# EAGLE design Grove - GSR v1.0 (EAGLE 6.3)
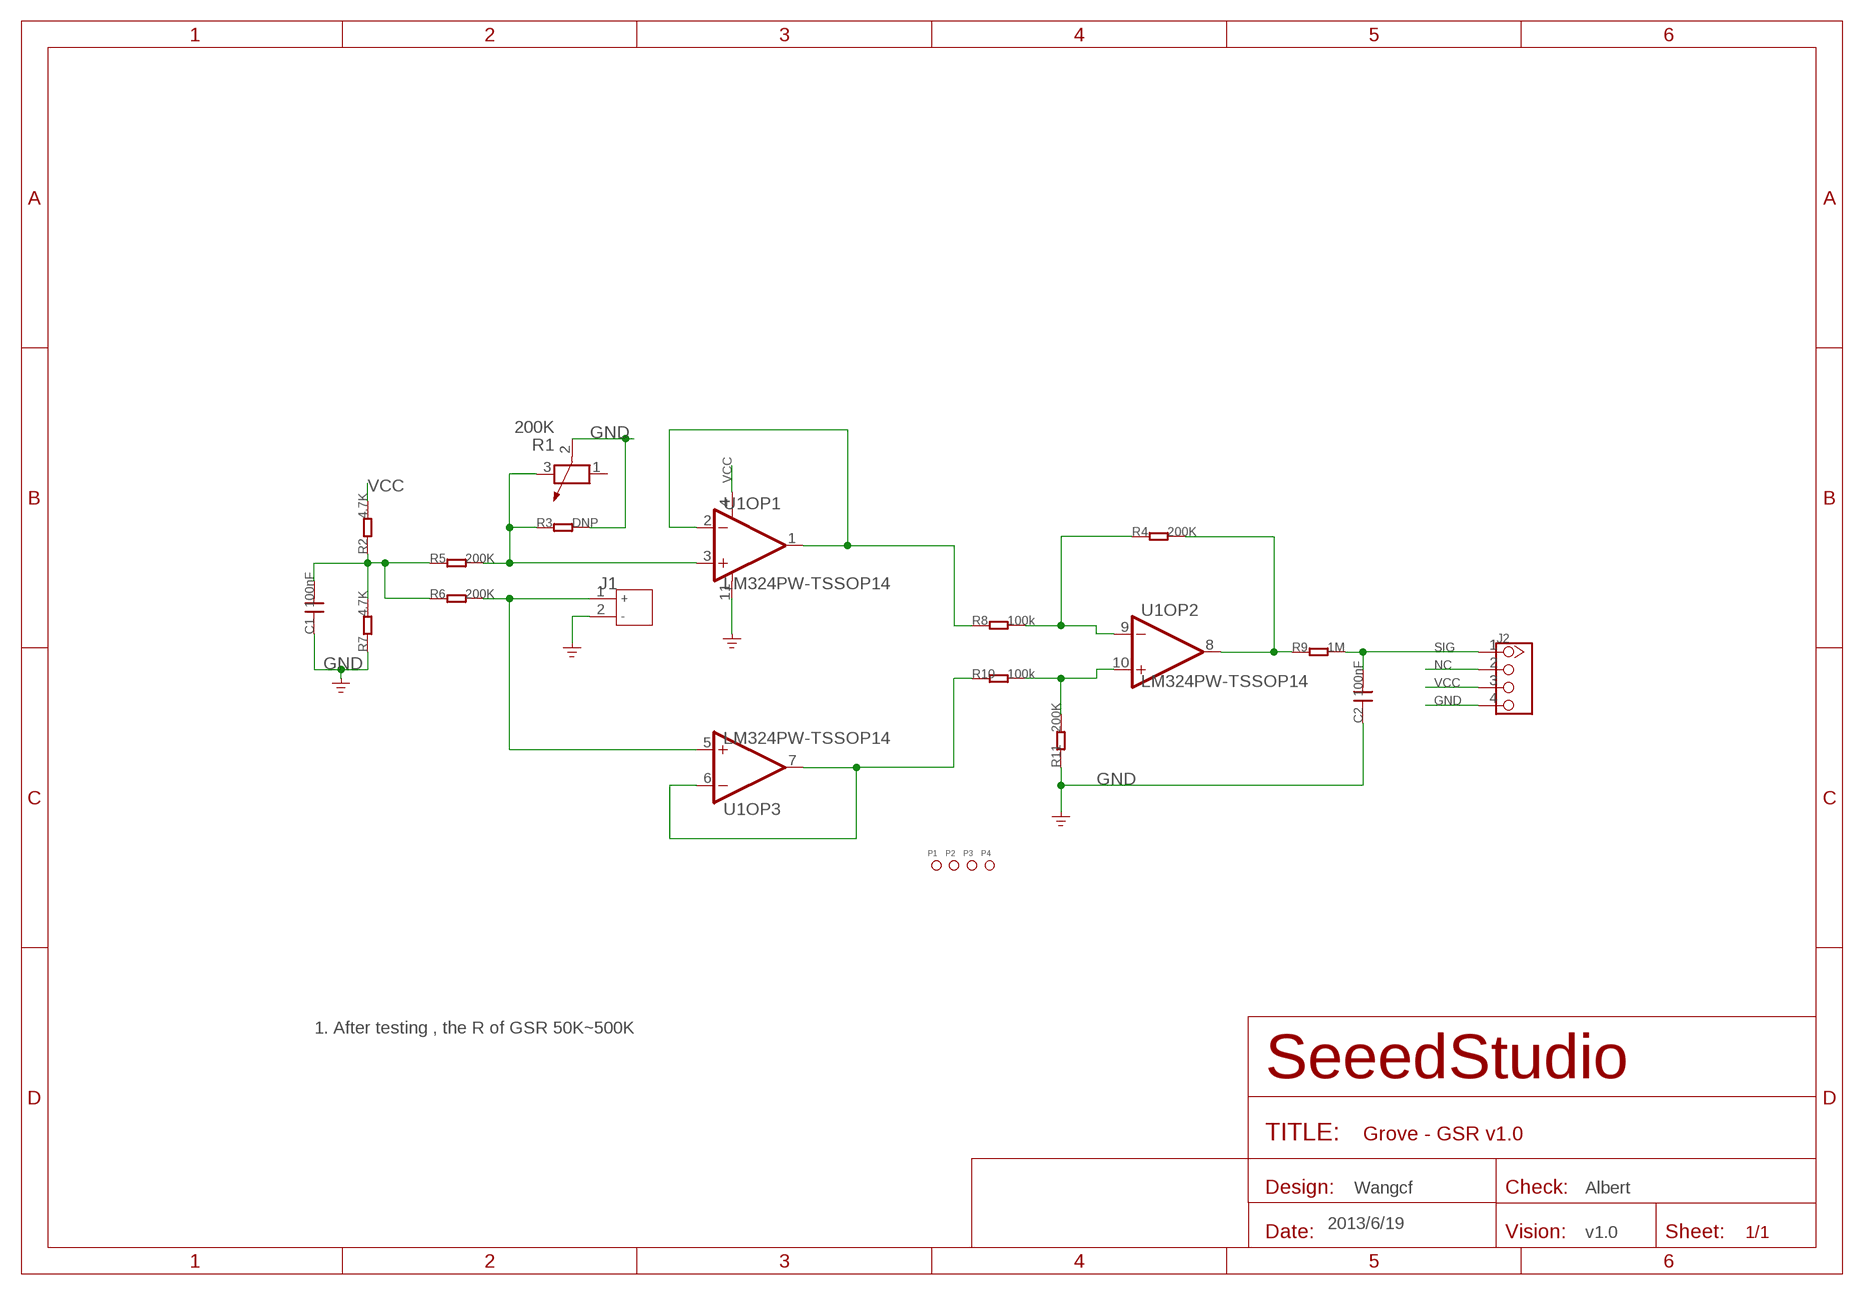
[diagram p0: schematic, sheet 1]

## Parts
C1  100nF  C-0603  [0603]
C2  100nF  C-0603  [0603]
J1  JACK-JST-2P-PW'2.0'  [JST-2.0]
J2  TWIG-4P-2.0-2.0  [4P-2.0]
P1  PAD-MARK  [ROUND-MARK-1.0]
P2  PAD-MARK  [ROUND-MARK-1.0]
P3  PAD-MARK  [ROUND-MARK-1.0]
P4  PAD-MARK  [ROUND-MARK-1.0]
R1  200K  R-POTENTIOMETER-SMD  [3P-SMD-RECT-3.3X3.6]
R2  4.7K  R-0603  [0603]
R3  DNP  R-0603  [0603]
R4  200K  R-0603  [0603]
R5  200K  R-0603  [0603]
R6  200K  R-0603  [0603]
R7  4.7K  R-0603  [0603]
R8  100k  R-0603  [0603]
R9  1M  R-0603  [0603]
R10  100k  R-0603  [0603]
R11  200K  R-0603  [0603]
U1  LM324PW-TSSOP14  LMV324-TSSOP14  [TSSOP14]

## Nets
GND: C1.1 C2.1 J1.2 J2.4 R1.2 R3.2 R7.1 R11.1 U1.11(OP1:V-)
IN: J1.1 R6.2 U1.5(OP3:IN+)
N$1: R8.1 U1.1(OP1:OUT) U1.2(OP1:IN-)
N$2: R10.1 U1.6(OP3:IN-) U1.7(OP3:OUT)
N$3: R4.1 R8.2 U1.9(OP2:IN-)
N$4: R4.2 R9.1 U1.8(OP2:OUT)
N$5: R10.2 R11.2 U1.10(OP2:IN+)
N$6: C1.2 R2.1 R5.1 R6.1 R7.2
N$8: R1.3 R3.1 R5.2 U1.3(OP1:IN+)
NC: J2.2
SIG: C2.2 J2.1 R9.2
VCC: J2.3 R2.2 U1.4(OP1:V+)
Unconnected: R1.1 U1.12(OP4:IN+) U1.13(OP4:IN-) U1.14(OP4:OUT)

## Notes on the sheet
- 1. After testing , the R of GSR 50K~500K
- Wangcf | Albert
- 2013/6/19
- v1.0

## Library data of the parts
C1 C2 = Discreter:C*: Ceramic Capacitors
J1 = Connector:JACK-JST-2P-PW
J2 = Connector:TWIG-4P-2.0
P1-P4 = Discrete:PAD-MARK; PARTNO: DNP
R1 = Discreter:R-POTENTIOMETER*: Potentiometer
R2-R11 = Discreter:R*
U1 = IC:LMV324: General purpose LOW Voltage, Rail-to-Rail Output Amplifiers http://www.fairchildsemi.com/ds/LM/LMV358.pdf

## Board
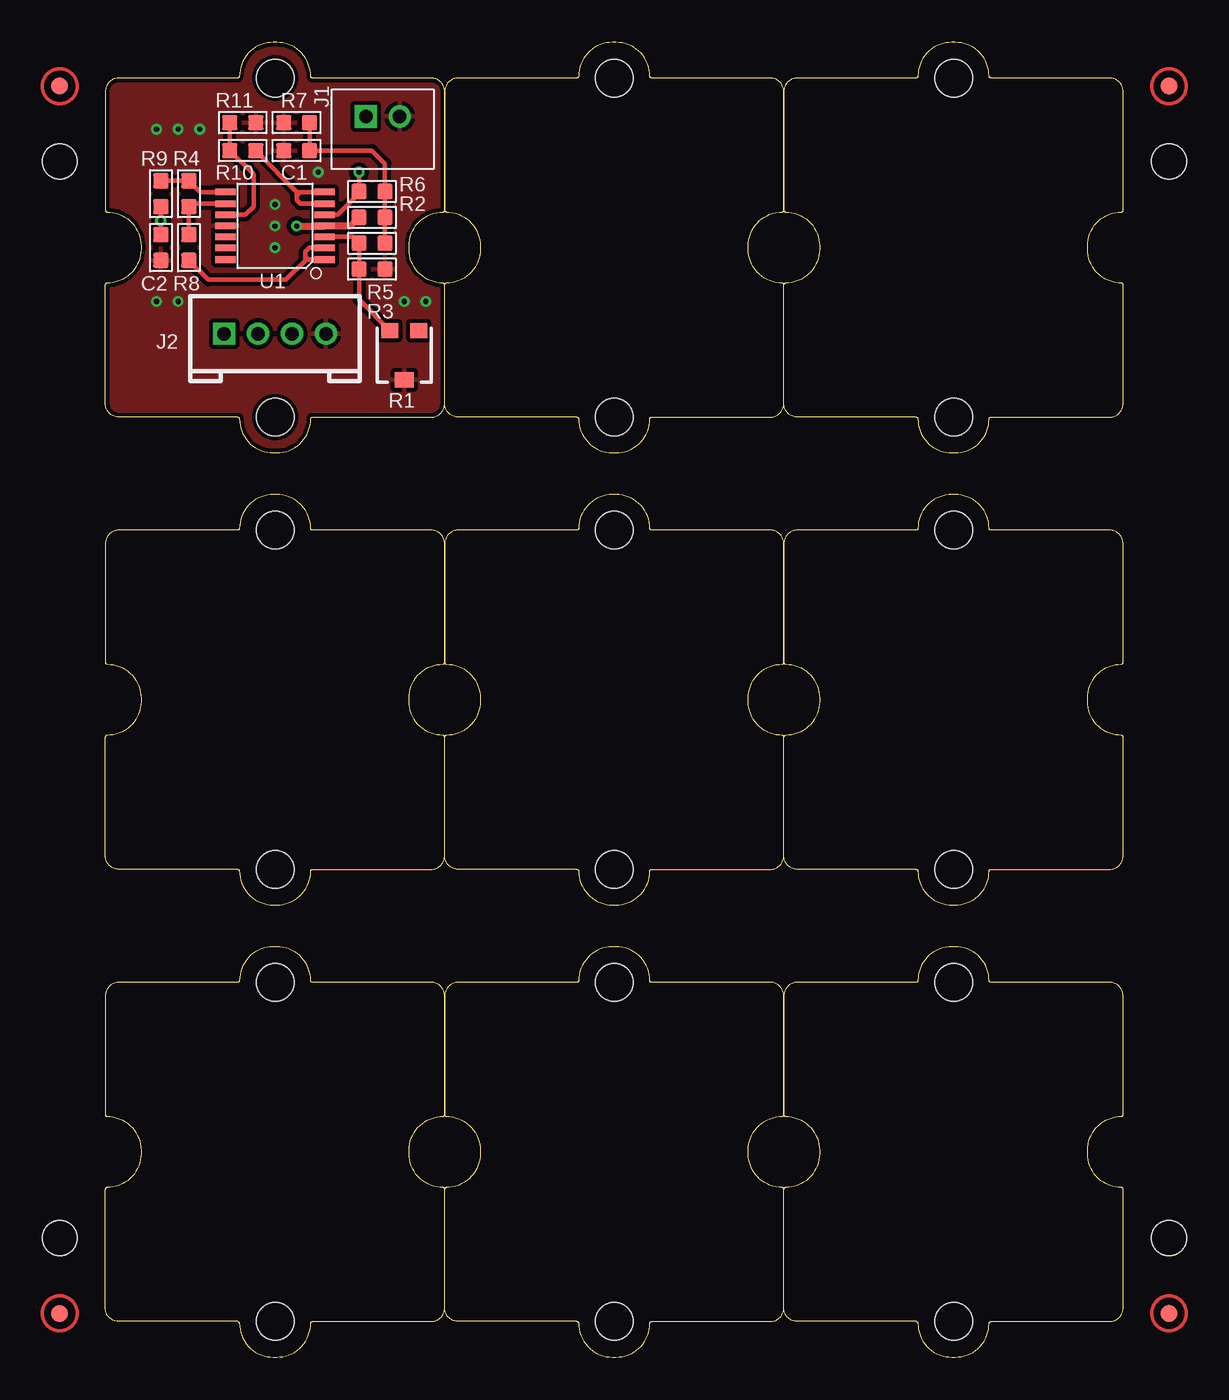
[diagram p1: board, top side]
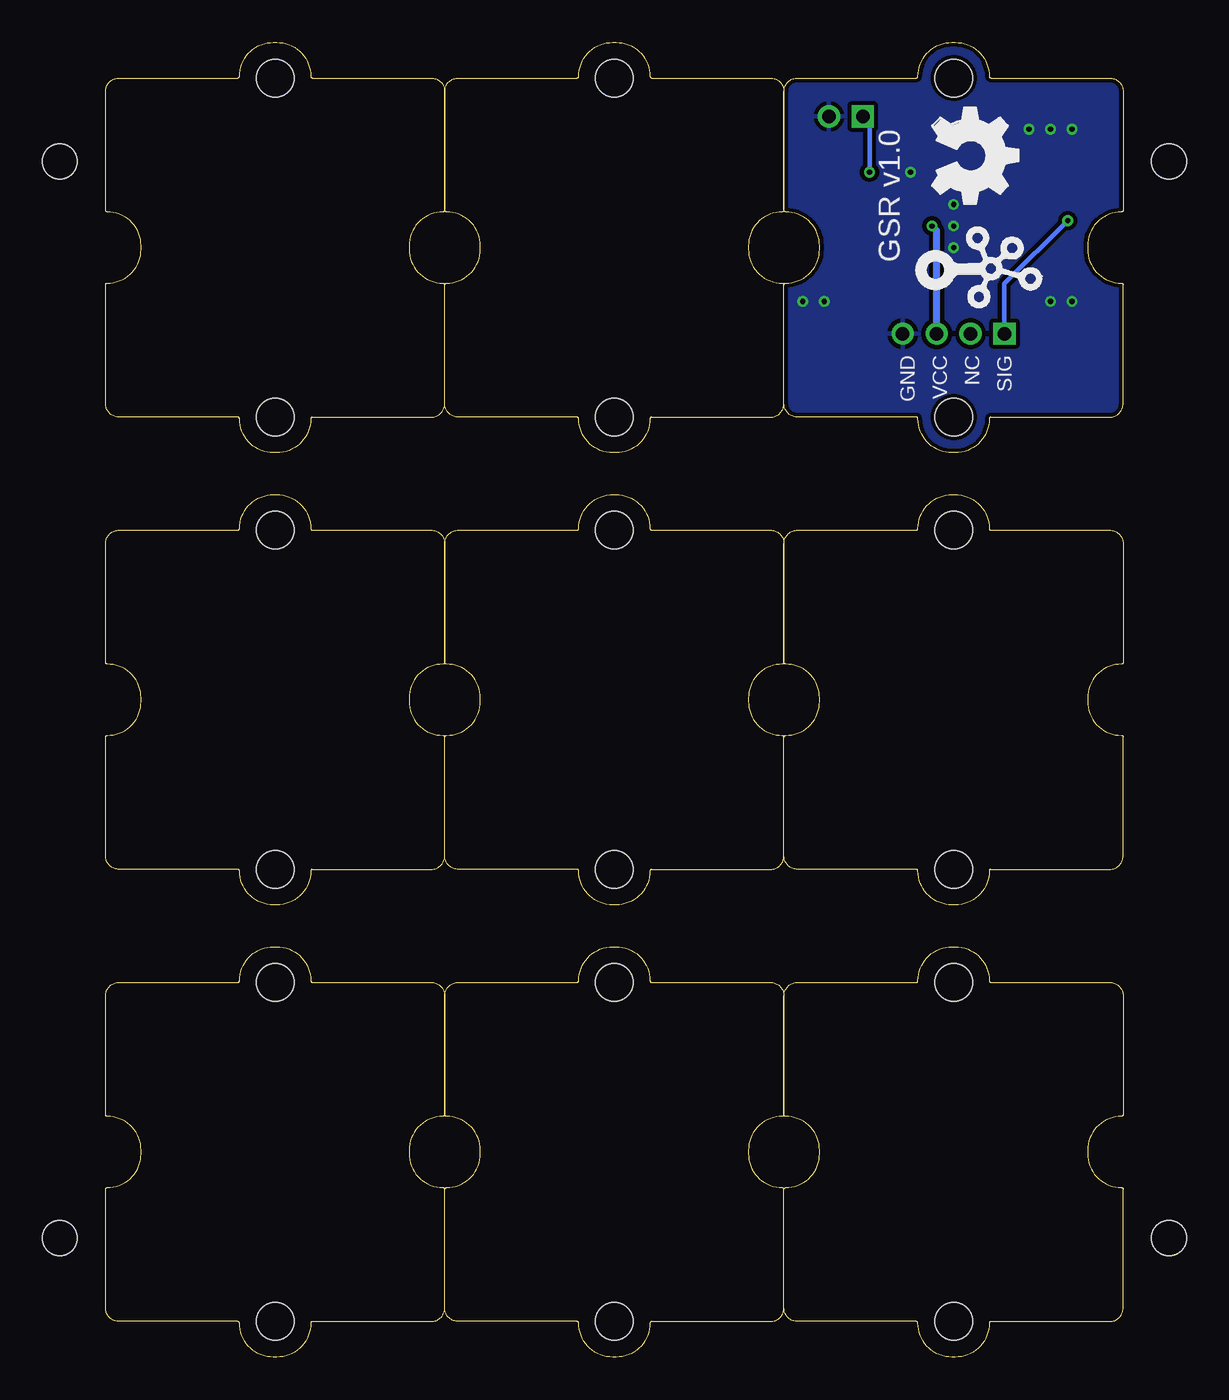
[diagram p2: board, bottom side, seen from below]

Size 60 x 77.54 mm. Coordinates in mm from the lower left corner, seen from the top.
Copper layers (1*16): Top 0.035mm / dielectric 1.5mm / Bottom 0.035mm
Design rules "SeeedStudio_rule_no_angle_090911 *": minimum track width 6mil, minimum drill 12mil, track to track 6mil, track to pad 6mil, pad to pad 6mil, via to via 6mil, smd to smd 0mil, copper to edge 10mil, drill to drill 10mil, minimum pad ring 10mil, minimum via ring 6mil, stop-mask expansion 2mil, vias tented up to drill 100mil, thermal gap 10mil
Holes 2.03 mm at -2.7,70.52 62.7,7.02 -2.7,7.02 62.7,70.52

### Footprints (pad centres in the part's own frame; a part is rotated, then mirrored left to right if it is on the bottom)
0603 = smd 0.889 x 0.889: 1 -0.762,0; 2 0.762,0
JST-2.0 = drill 0.8 pad 1.3 square: 1 -1,0.75 | drill 0.8 pad 1.3: 2 1,0.75
4P-2.0 = drill 0.8 pad 1.27 square: 1 -3,0 | drill 0.8 pad 1.27: 2 -1,0; 3 1,0; 4 3,0
ROUND-MARK-1.0 = smd 1.016 x 1.016: P$1 0,0
3P-SMD-RECT-3.3X3.6 = smd 1 x 0.9: 1 -0.85,-1.45; 3 0.85,-1.45 | smd 1.1 x 0.9: 2 0,1.45
TSSOP14 = smd 0.4 x 1.2: 1 -2,-2.925; 2 -1.3,-2.925; 3 -0.65,-2.925; 4 0,-2.925; 5 0.65,-2.925; 6 1.3,-2.925; 7 2,-2.925; 8 2,2.925; 9 1.3,2.925; 10 0.65,2.925; 11 0,2.925; 12 -0.65,2.925; 13 -1.3,2.925; 14 -2,2.925
1U-DIM-W/-DRILL = hole 2.2: 0,-10; 0,10

### Placement (x,y rotation side)
C1  11.27,71.16 0 top
C2  3.27,65.44 90 top
J1  16.35,72.42 0 top
J2  10,60.36 0 top
P1  -2.7,74.97 0 top
P2  62.7,74.97 0 top
P3  62.7,2.57 0 top
P4  -2.7,2.57 0 top
R1  17.62,59.09 180 top
R2  15.71,67.22 180 top
R3  15.71,64.17 0 top
R4  4.92,68.61 90 top
R5  15.71,65.69 180 top
R6  15.71,68.74 180 top
R7  11.27,72.81 0 top
R8  4.92,65.44 90 top
R9  3.27,68.61 270 top
R10  8.1,71.16 180 top
R11  8.1,72.81 180 top
U1  10,66.72 90 top
U$5  [1U-DIM-W/-DRILL]  10,65.44 180 top
U$7  [TWIGLOGO]  11.27,64.17 270 bottom
U$8  [OSHW_FILLX200_NOTEXT]  11.27,73.69 270 bottom
U$9  [1U-DIM-W/-DRILL]  10,38.77 180 top
U$10  [1U-DIM-W/-DRILL]  10,12.1 180 top
U$12  [1U-DIM-W/-DRILL]  30,38.77 180 top
U$13  [1U-DIM-W/-DRILL]  30,65.44 180 top
U$14  [1U-DIM-W/-DRILL]  30,12.1 180 top
U$15  [1U-DIM-W/-DRILL]  50,65.44 180 top
U$16  [1U-DIM-W/-DRILL]  50,38.77 180 top
U$17  [1U-DIM-W/-DRILL]  50,12.1 180 top

### Tracks (layer width: path | path; a pad name or v marks a point on that pad's centre or on a via)
GND  (via drill 0.3 pad 0.64)
  other vias: 10,66.71 10,65.44 12.54,69.88 5.55,72.42 4.29,72.42 3.01,72.42 10,67.98 17.62,62.27 18.89,62.27 4.29,62.27 3.01,62.27
  pour Top (isolate 0.254): 20.16,53.38 20.16,77.5 -0.16,77.5 -0.16,53.38
  pour Bottom (isolate 0.254): 20.16,53.38 20.16,77.5 -0.16,77.5 -0.16,53.38
IN  (via drill 0.3 pad 0.64)
  Top 0.254: U1.5 13.71,67.37 14.83,68.49 14.83,68.61 R6.2 v14.95,69.88
  Bottom 0.254: v14.95,69.88 14.95,72.78 J1.1
N$1
  Top 0.254: U1.1 11.95,64.72 | 11.95,64.72 11.82,64.72 11.78,64.68 | 11.78,64.68 10.63,63.53 6.06,63.53 R8.1 | U1.2 12.01,65.42 11.78,65.19 11.78,64.93 | 11.78,64.93 11.78,64.68 | 11.95,64.72 11.95,64.76 11.78,64.93
N$2
  Top 0.254: U1.7 11.47,68.72 | 11.47,68.72 11.29,68.72 | 11.29,68.72 R10.1 | U1.6 11.48,68.02 11.27,68.23 11.27,68.49 | 11.27,68.49 11.27,68.7 11.29,68.72 | 11.47,68.72 11.47,68.69 11.27,68.49
N$3
  Top 0.254: U1.9 5.09,68.02 R4.1 R8.2
N$4
  Top 0.254: U1.8 5.58,68.72 R4.2 R9.1
N$5
  Top 0.254: U1.10 8.25,67.37 8.73,67.85 8.73,69.76 R10.2 R11.2
N$6
  Top 0.254: R5.1 R2.1 R6.1 16.48,70.39 15.71,71.16 C1.2 R7.2
N$8
  Top 0.254: U1.3 14.58,66.07 R5.2 R3.1 14.95,62.36 R1.3
SIG  (via drill 0.3 pad 0.64)
  Top 0.254: R9.2 v3.27,67.03 C2.2
  Bottom 0.254: J2.1 7,63.3 v3.27,67.03
VCC  (via drill 0.3 pad 0.64)
  Top 0.254: 13.04,66.71 13.05,66.72
  Top 0.406: R2.2 14.45,66.72 13.05,66.72 U1.4 v11.27,66.71
  Bottom 0.406: J2.3 11,66.44 v11.27,66.71

### Text on the board
bPlace: GSR v1.0 | SIG | NC | VCC | GND